# Altium schematic sheet isoDebug-Connectors.SchDoc
size A4; SheetNumber: 19
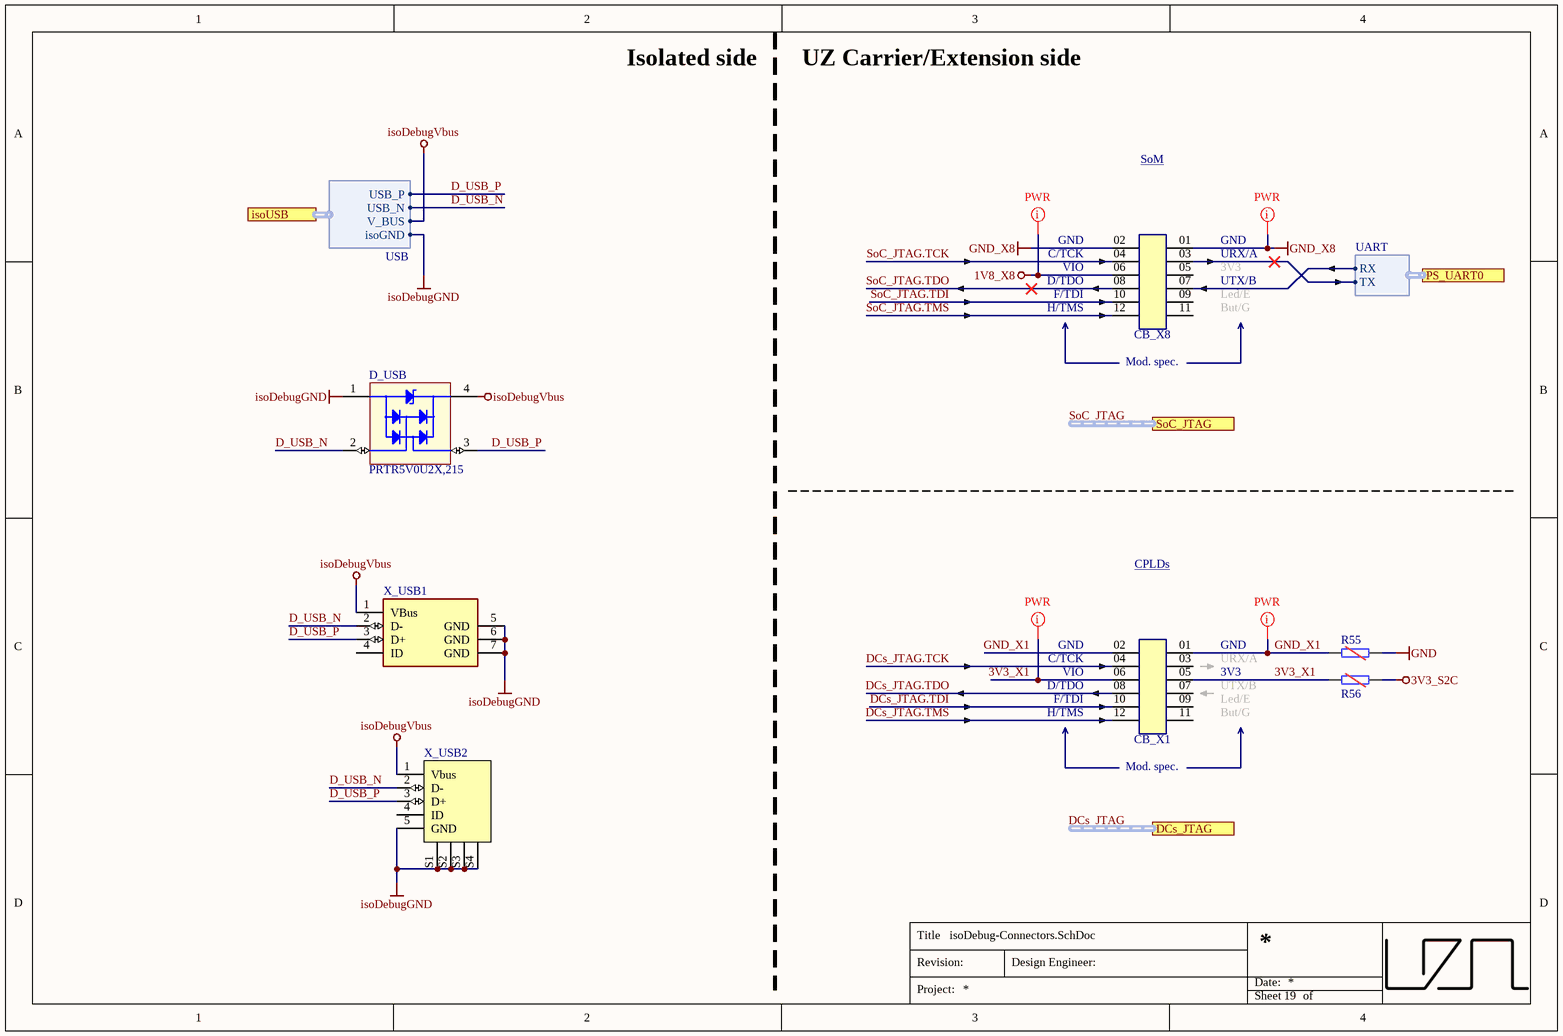
[diagram p0: isoDebug-Connectors.SchDoc]

## Parts
CB_X1  PH 0.1" SMD 2x06  [TSM-106-01-L-DV_Mirrored12+Triangle02]  (value not drawn)
CB_X8  PH 0.1" SMD 2x06  [TSM-106-01-L-DV_Mirrored12+Triangle02]  (value not drawn)
D_USB  PRTR5V0U2X,215  [SOT-143B-4]
R55  DNP  [R_1206_TE-DNP]  (value not drawn)  (no BOM)
R56  DNP  [R_1206_TE-DNP]  (value not drawn)  (no BOM)
X_USB1  Mini USB 90  [920-462A2021Y10102_CUSTOMANLRING0.2mm]  (value not drawn)
X_USB2  Mini USB  [MINI_USB_5S_B _TYPE]  (value not drawn)

## Ports
DCs_JTAG (harness JTAG), isoUSB (harness USB), PS_UART0 (harness UART), SoC_JTAG (harness JTAG)

## Harnesses
USB: USB_P, USB_N, V_BUS, isoGND
UART: RX, TX

## Nets
1V8_X8: CB_X8.06
3V3_S2C: R56.2
GND: R55.2
GND_X8: CB_X8.01 CB_X8.02
isoDebugGND: D_USB.1(GND) X_USB1.5(GND) X_USB1.6(GND) X_USB1.7(GND) X_USB2.5(GND) X_USB2.S1 X_USB2.S2 X_USB2.S3 X_USB2.S4 ; port isoUSB.isoGND
isoDebugVbus: D_USB.4(REF) X_USB1.1(VBus) X_USB2.1(Vbus) ; port isoUSB.V_BUS
3V3_X1: CB_X1.05 CB_X1.06 R56.1
D_USB_N: D_USB.2(I/O) X_USB1.2(D-) X_USB2.2(D-) ; port isoUSB.USB_N
D_USB_P: D_USB.3(I/O) X_USB1.3(D+) X_USB2.3(D+) ; port isoUSB.USB_P
DCs_JTAG.TCK: CB_X1.04
DCs_JTAG.TDI: CB_X1.10
DCs_JTAG.TDO: CB_X1.08
DCs_JTAG.TMS: CB_X1.12
GND_X1: CB_X1.01 CB_X1.02 R55.1
SoC_JTAG.TCK: CB_X8.04
SoC_JTAG.TDI: CB_X8.10
SoC_JTAG.TDO: CB_X8.08
SoC_JTAG.TMS: CB_X8.12
NetCB_X8_03: CB_X8.03 ; port PS_UART0.TX
NetCB_X8_07: CB_X8.07 ; port PS_UART0.RX

Not connected (* = marked no-connect by the designer): CB_X1 03 07 09 11; CB_X8 05 09 11; X_USB1 4(ID); X_USB2 4(ID)

## Buses and harness runs
harness DCs_JTAG = port DCs_JTAG
harness SoC_JTAG = port SoC_JTAG

## Layout directives
net class PWR: 1V8_X8, 3V3_X1, GND_X1, GND_X8

## Notes on the sheet
- Isolated side
- UZ Carrier/Extension side
- SoM
- GND
- C/TCK
- VIO
- D/TDO
- F/TDI
- H/TMS
- URX/A
- 3V3
- UTX/B
- Led/E
- But/G
- (near CB_X8) Mod. spec.
- CPLDs
- (near CB_X1) Mod. spec.
- Title
- Revision:
- Design Engineer:
- Date:
- Project:
- Sheet
- of

## Library data of the parts
CB_X1 CB_X8 = UZgen_Conn_PinHead_2x06_SMD_100mil_90deg_mirrored12triangle02: 0.1" Double-row Pin Header, 90°-to-PCB SMD, 2x06 Pins, 250V, 3A (mirrored pin rows 1/2, with triangle marker at pin 02); Manufacturer: UZgen; Pin Pitch: 0.1" x 0.1"; Pin Orientation: 90° (standing); Created from: UZgenTool; Manufacturer Part Number: UZgen_Conn_PinHead_2x06_SMD_100mil_90deg_mirrored12triangle02; PartID: 21; Created On: 27/03/2025 13:58:45; Value: PH 0.1" SMD 2x06; Device Package: SMD 0.1" 2x06; Pin Count: 12; Pin Layout: 2x06; Pin Voltage: 250V; Pin Current: 3A; Mounting Type: SMD; Last Updated: 27/03/2025 13:58:45
D_USB = PRTR5V0U2X,215: ESD Suppressors / TVS Diodes PRTR5V0U2X/SOT143/SOT4; Manufacturer: Nexperia; Created from: AGeiger; Manufacturer Part Number: PRTR5V0U2X,215; PartID: 10; Created On: 26.11.2023 17:14:11; ComponentLink1Description: Datasheet; ComponentLink1URL: https://www.mouser.de/datasheet/2/916/PRTR5V0U2X-2938759.pdf; Component Type: TVS Diode, ESD; Device Package: SOT-143B-4; Last Updated: 26.11.2023 17:16:37; Mounting Type: SMD; Operating Temperature: -40 to 85 °C; Supplier 1: Mouser; Supplier Part Number 1: 771-PRTR5V0U2X-T/R; Supplier 2: LCSC; Supplier Part Number 2: C12333; Type: TVS-Diode; Value: PRTR5V0U2X,215; Live Cycle Status: 1; LCSC Part Number: C12333
R55 R56 = UZgen_R_1206_DNP: Generic resistor (DNP); Manufacturer: UZgen; Created from: UZgenTool; Manufacturer Part Number: UZgen_R_1206_DNP; PartID: 595; Created On: 25/03/2025 14:26:15; Value: DNP; Device Package: 1206; Tolerance: -; Mounting Type: SMD; Last Updated: 02/04/2025 19:05:00
X_USB1 = 920-462A2021Y10102: USB 2.0 1 5P Female Mini-B Plugin USB Connectors ROHS; Manufacturer: Jing Extension of the Electronic Co.; Created from: FRosner; Manufacturer Part Number: 920-462A2021Y10102; PartID: 55; Created On: 28/02/2025 09:59:57; ComponentLink1Description: Datasheet; ComponentLink1URL: https://www.lcsc.com/datasheet/lcsc_datasheet_2103051832_Jing-Extension-of-the-Electronic-Co--920-462A2021Y10102_C13453.pdf; Last Updated: 23/05/2025 19:07:30; Mounting Type: SMD; Operating Temperature: -30 °C to +80 °C; Series: Mini USB; Supplier 1: LCSC; Supplier Part Number 1: C13453; Value: Mini USB 90; LCSC Part Number: C13453
X_USB2 = MINI 5PTP: 1A 1 Surface Mount 5P Female -30℃~+80℃ SMD USB Connectors ROHS; Manufacturer: SHOU HAN; Created from: AGeiger; Manufacturer Part Number: MINI 5PTP; PartID: 24; Created On: 26/11/2023 17:41:34; ComponentLink1Description: Datasheet; ComponentLink1URL: https://datasheet.lcsc.com/lcsc/2101221940_SHOU-HAN-MINI-5PTP_C2681563.pdf; Last Updated: 26/11/2023 17:41:34; Mounting Type: SMD; Operating Temperature: -30 °C to +80 °C; Series: Mini USB; Supplier 1: LCSC; Supplier Part Number 1: C2681563; Value: Mini USB; LCSC Part Number: C2681563